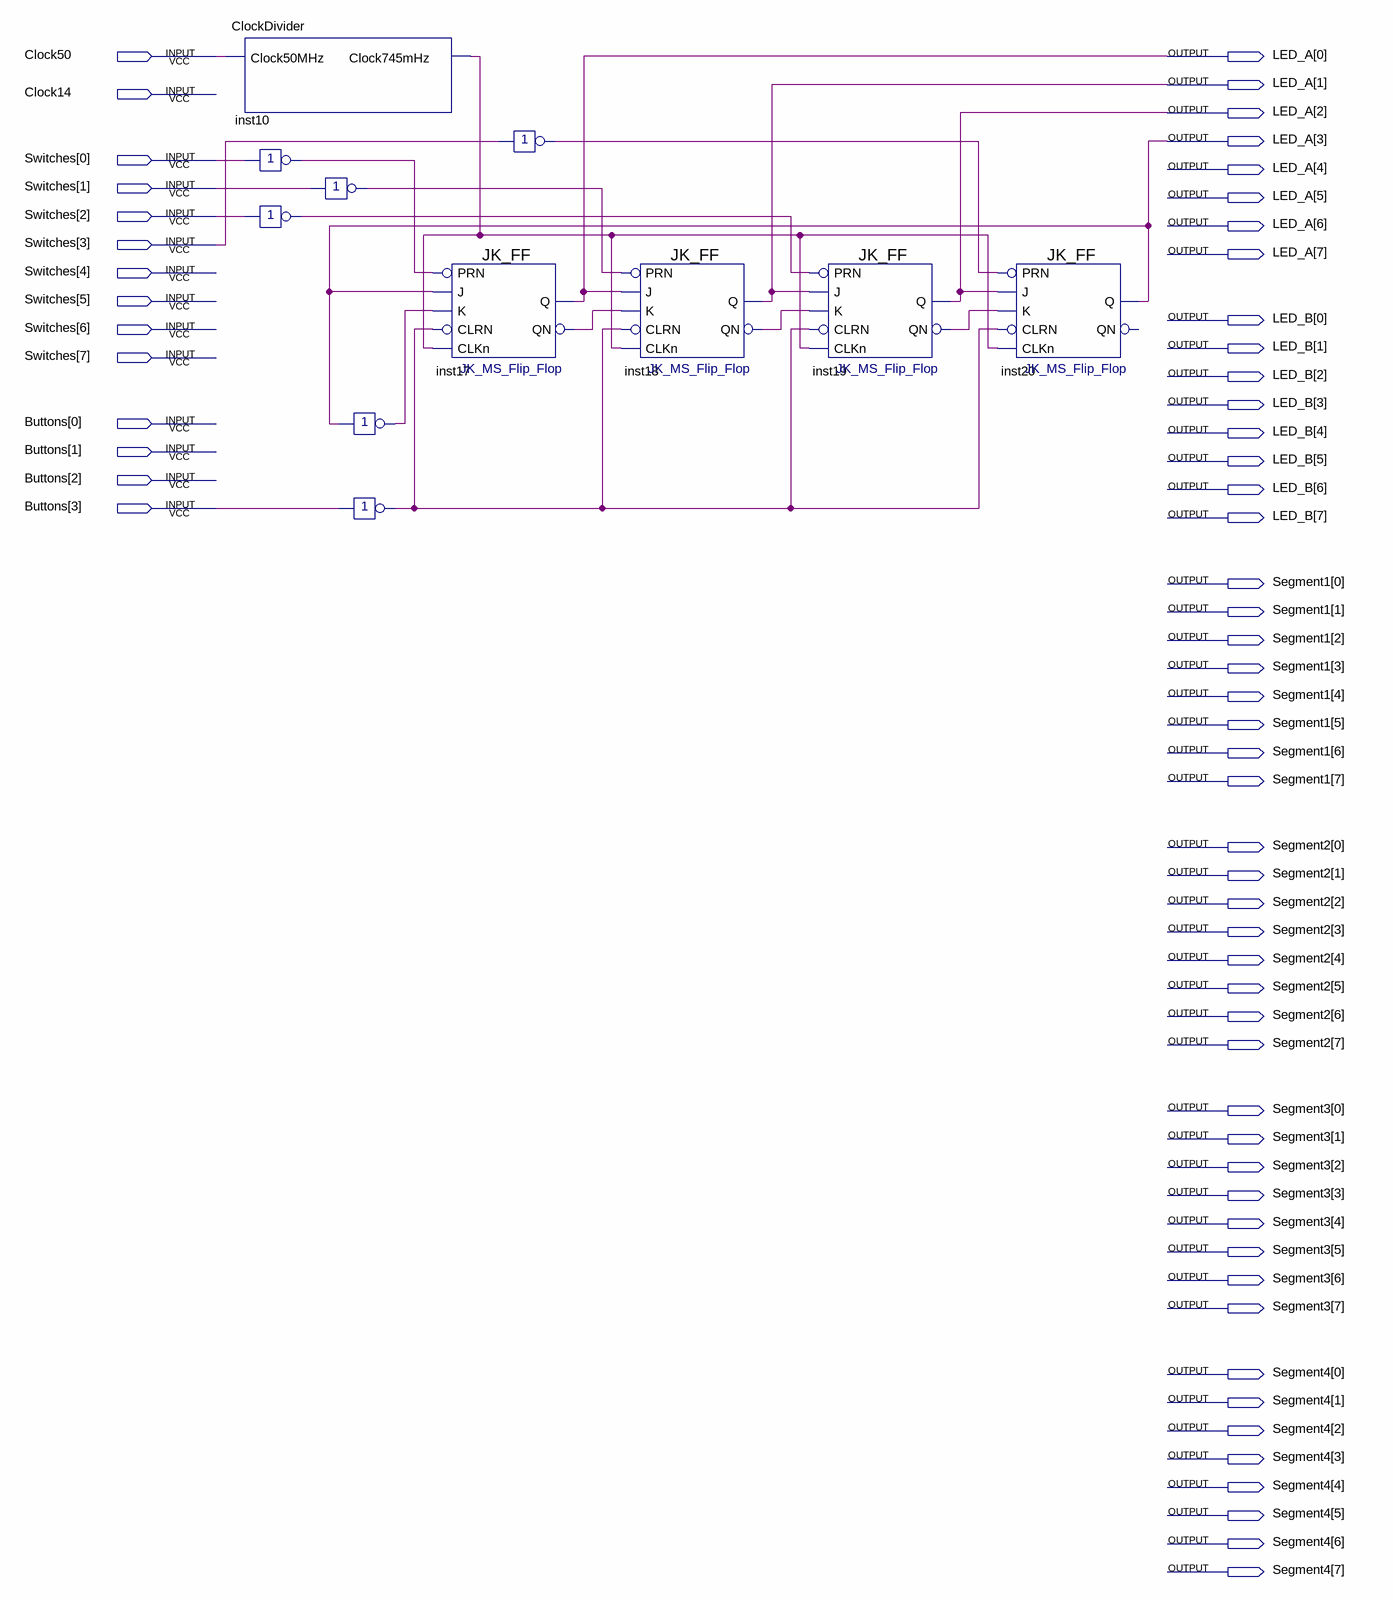
[diagram p0: schematic sheet]
// Quartus schematic Rotationsregister.bdf as structural Verilog: 11 symbols, 62 pins
module Rotationsregister (
  input  Clock50,
  input  Clock14,
  input  [7:0] Switches,
  input  [3:0] Buttons,
  output [7:0] LED_A,
  output [7:0] LED_B,
  output [7:0] Segment1,
  output [7:0] Segment2,
  output [7:0] Segment3,
  output [7:0] Segment4
);

  wire inst10_clock745mhz, inst11_out, inst12_out, inst13_out, inst14_out, inst15_out, inst16_out, inst17_qn,
       inst18_qn, inst19_qn;

  ClockDivider inst10 (.Clock50MHz(Clock50), .Clock745mHz(inst10_clock745mhz));
  not inst11 (inst11_out, Switches[0]);
  not inst13 (inst13_out, Switches[2]);
  not inst14 (inst14_out, Switches[1]);
  not inst12 (inst12_out, LED_A[3]);
  not inst15 (inst15_out, Buttons[3]);
  JK_FF inst17 (
    .PRN(inst11_out), .K(inst12_out), .J(LED_A[3]), .CLRN(inst15_out), .CLKn(inst10_clock745mhz),
    .QN(inst17_qn), .Q(LED_A[0]));
  not inst16 (inst16_out, Switches[3]);
  JK_FF inst18 (
    .PRN(inst14_out), .K(inst17_qn), .J(LED_A[0]), .CLRN(inst15_out), .CLKn(inst10_clock745mhz),
    .QN(inst18_qn), .Q(LED_A[1]));
  JK_FF inst19 (
    .PRN(inst13_out), .K(inst18_qn), .J(LED_A[1]), .CLRN(inst15_out), .CLKn(inst10_clock745mhz),
    .QN(inst19_qn), .Q(LED_A[2]));
  JK_FF inst20 (
    .PRN(inst16_out), .K(inst19_qn), .J(LED_A[2]), .CLRN(inst15_out), .CLKn(inst10_clock745mhz), .Q(LED_A[3]));  // open: QN
endmodule
